# Altium schematic sheet Connectors.SchDoc
size A; SheetNumber: 1; SheetTotal: 5
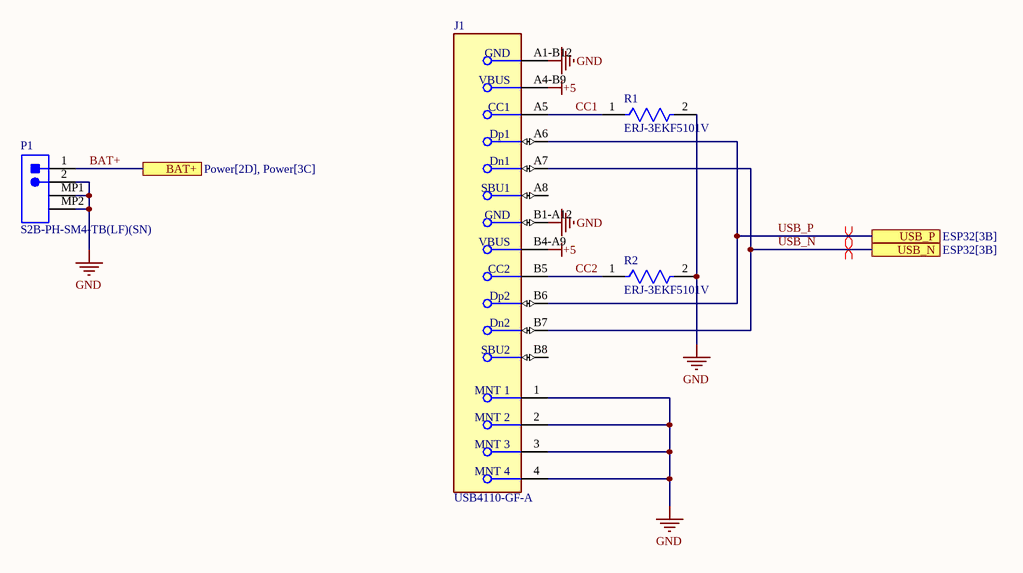
[diagram p0: Connectors.SchDoc]

## Parts
J1  USB4110-GF-A  [FP-USB4110-GF-A-MFG]
P1  S2B-PH-SM4-TB(LF)(SN)  [JST- S2B-PH-SM4-TB(LF)(SN)-2_V]
R1  ERJ-3EKF5101V  [FP-ERJ3EK-MFG]
R2  ERJ-3EKF5101V  [FP-ERJ3EK-MFG]

## Ports
BAT+ (see Power[2D], Power[3C]), USB_N (see ESP32[3B]), USB_P (see ESP32[3B])

## Nets
+5: J1.A4-B9(VBUS) J1.B4-A9(VBUS)
GND: J1.1(MNT_1) J1.2(MNT_2) J1.3(MNT_3) J1.4(MNT_4) J1.A1-B12(GND) J1.B1-A12(GND) P1.2 P1.MP1 P1.MP2 R1.2 R2.2
BAT+: P1.1 ; port BAT+
CC1: J1.A5(CC1) R1.1
CC2: J1.B5(CC2) R2.1
USB_N: J1.A7(Dn1) J1.B7(Dn2) ; port USB_N
USB_P: J1.A6(Dp1) J1.B6(Dp2) ; port USB_P

Not connected (* = marked no-connect by the designer): J1 A8(SBU1) B8(SBU2)

## Layout directives
differential pair: USB_N, USB_P

## Library data of the parts
J1 = CMP-245163-000002-1: CONN USB 2.0 TYPE-C R/A SMT; Manufacturer: GCT; Conn Orientation: Right Angle; Usb Standard: USB 2.0; Voltage Rating: 20V; Current Rating: 3/4.25/1.25/0.25A; Number Of Contacts: 16; Is Female: yes; Shielding: true; Standoff Height: 0.1mm; Octopart: https://octopart.com/usb4110-gf-a-gct-103941985; Temperature: -40°C to +85°C; RoHS: TRUE; Automotive: No; Contact Material: Gold,Nickel; Device Class L1: Connectors; Device Class L2: USB Connectors; Package: 0; Lead Free: Yes; ComponentLink2URL: https://gct.co/files/drawings/usb4110.pdf; Temperature Range High: +85°C; Temperature Range Low: -40°C; Height: 3.46mm; Manufacturer Part Number: USB4110-GF-A; ComponentLink2Description: Datasheet; Device Class L3: unset; Digikey Description: CONN USB 2.0 TYPE-C R/A SMT; Category: Conn
P1 = CMP-1755-00001-1: Male Header, Pitch 2 mm, 1 x 2 Position, Height 5.5 mm, -25 to 85 degC, RoHS, Tape and Reel; Current Rating: 3 A; ComponentLink1URL: http://www.jst.com/home2.html; Radiation Hardening: No; RoHSCompliant: True; Mount: Through Hole; Contact Material: Bronze; Package Quantity: 100; Width: 2.34 mm; DatasheetVersion: Dec-12; Height: 8.13 mm; Max Operating Temperature: 105degC; ComponentLink2Description: Datasheet; Lead Pitch: 0.1 inch; Contact Finish: Lead; Packaging: Bulk; Colour: Black; Contact Plating: Tin; Min Operating Temperature: -65degC; ComponentLink1Description: Manufacturer URL; PackageReference: S2B-PH-SM4-TB(LF)(SN)-2; PackageDescription: Male Header, Pitch 2 mm, 1 x 2 Position, Height 5.5 mm; ComponentLink2URL: http://www.jst-mfg.com/product/pdf/eng/ePH.pdf; Pins: 40; Length: 101.19 mm
R1 R2 = CMP-2000-00540-8: RES SMD 5.1K OHM 1% 1/10W 0603; Power Rating: 100mW; Temperature Coefficient: 100ppm/°C; Voltage Rating: 75V; Resistance: 5.1kR; Military Standard: Not; Case/Package: 0603; Packaging: Tape and Reel; Package Quantity: 1; Reach SVHC Compliant: Yes; Lead Free: Lead Free; Mount: Surface Mount; Size Code: 0603; Depth: 0.8mm; Resistance Tolerance: 1%; Number of Terminations: 2; Resistor Type: Thick Film; Width: 0.8mm; Construction: Rectangular; Series: ERJ; Radiation Hardening: No; Max Operating Temperature: 155°C; Features: Automotive AEC-Q200; Tolerance: 1%; Voltage Rating (DC): 75V; Length: 1.6mm; RoHS Compliant: Yes; Min Operating Temperature: -55°C; Case Code (Metric): 1608; Termination: SMD/SMT; Weight: 7.1E-05oz; Max Power Dissipation: 100mW; Contact Plating: Tin; Height: 0.022inch; Case Code (Imperial): 0603